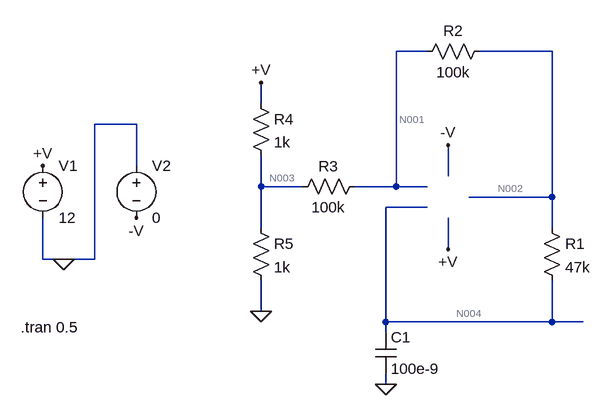
[diagram p0: schematic Draft1.asc]
Draft1.asc, the LTspice schematic file:
Version 4
SHEET 1 1076 680
WIRE 688 -64 640 -64
WIRE 880 -64 768 -64
WIRE 432 16 432 -16
WIRE 240 48 176 48
WIRE 240 112 240 48
WIRE 720 128 720 80
WIRE 432 144 432 96
WIRE 496 144 432 144
WIRE 640 144 640 -64
WIRE 640 144 576 144
WIRE 688 144 640 144
WIRE 880 160 880 -64
WIRE 880 160 752 160
WIRE 688 176 624 176
WIRE 432 208 432 144
WIRE 880 208 880 160
WIRE 720 240 720 192
WIRE 96 256 96 192
WIRE 128 256 96 256
WIRE 176 256 176 48
WIRE 176 256 128 256
WIRE 432 336 432 288
WIRE 624 352 624 176
WIRE 880 352 880 288
WIRE 880 352 624 352
WIRE 928 352 880 352
WIRE 624 368 624 352
WIRE 624 448 624 432
FLAG 96 112 +V
FLAG 240 192 -V
FLAG 128 256 0
FLAG 720 240 +V
FLAG 720 80 -V
FLAG 624 448 0
FLAG 432 336 0
FLAG 432 -16 +V
SYMBOL voltage 96 96 R0
SYMATTR InstName V1
SYMATTR Value 12
SYMBOL voltage 240 96 R0
SYMATTR InstName V2
SYMATTR Value 0
SYMBOL res 864 192 R0
SYMATTR InstName R1
SYMATTR Value 47k
SYMBOL cap 608 368 R0
SYMATTR InstName C1
SYMATTR Value 100e-9
SYMBOL res 784 -80 R90
WINDOW 0 0 56 VBottom 2
WINDOW 3 32 56 VTop 2
SYMATTR InstName R2
SYMATTR Value 100k
SYMBOL res 592 128 R90
WINDOW 0 0 56 VBottom 2
WINDOW 3 32 56 VTop 2
SYMATTR InstName R3
SYMATTR Value 100k
SYMBOL res 416 0 R0
SYMATTR InstName R4
SYMATTR Value 1k
SYMBOL res 416 192 R0
SYMATTR InstName R5
SYMATTR Value 1k
TEXT 62 360 Left 2 !.tran 0.5

The netlist it stands for:
* Draft1.asc
V1 +V 0 12
V2 0 -V 0
R1 N002 N004 47k
C1 N004 0 100e-9
R2 N002 N001 100k
R3 N001 N003 100k
R4 +V N003 1k
R5 N003 0 1k
.tran 0.5
.backanno
.end

* Results of the author's LTspice run, read from the files saved beside the schematic
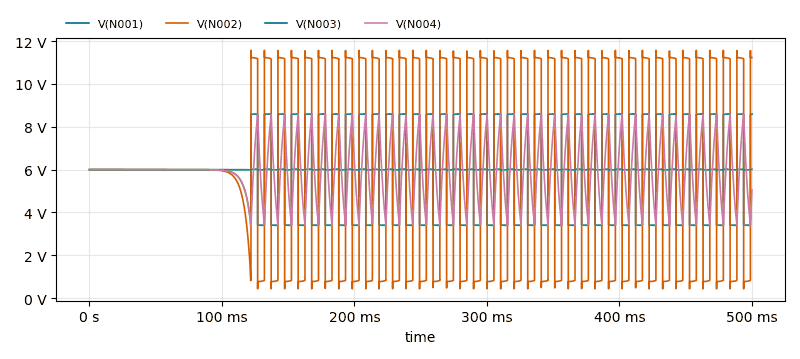
[diagram p1: Transient Analysis of Draft1.asc, plotted from the saved traces]
* Transient Analysis, 1 run:
*   V(N001): min 3.394 V, max 8.594 V, average 5.974 V, rms 6.387 V, last 8.583 V
*   V(N002): min 434.8 mV, max 11.56 V, average 5.959 V, rms 7.495 V, last 11.23 V
*   V(N003): min 5.987 V, max 6.013 V, average 6 V, rms 6 V, last 6.013 V
*   V(N004): min 3.405 V, max 8.583 V, average 5.964 V, rms 6.137 V, last 5.047 V